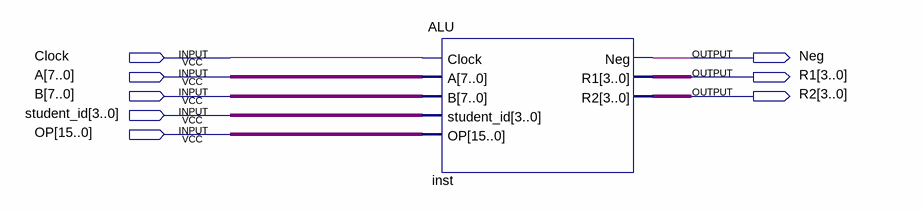
[diagram p0: schematic sheet]
// Quartus schematic alublock.bdf as structural Verilog: 1 symbols, 8 pins
module alublock (
  input  Clock,
  input  [7:0] A,
  input  [7:0] B,
  input  [3:0] student_id,
  input  [15:0] OP,
  output Neg,
  output [3:0] R1,
  output [3:0] R2
);

  ALU inst (.Clock(Clock), .A(A), .B(B), .student_id(student_id), .OP(OP), .Neg(Neg), .R1(R1), .R2(R2));
endmodule
